# EAGLE design usbExpansion (EAGLE 4.16)
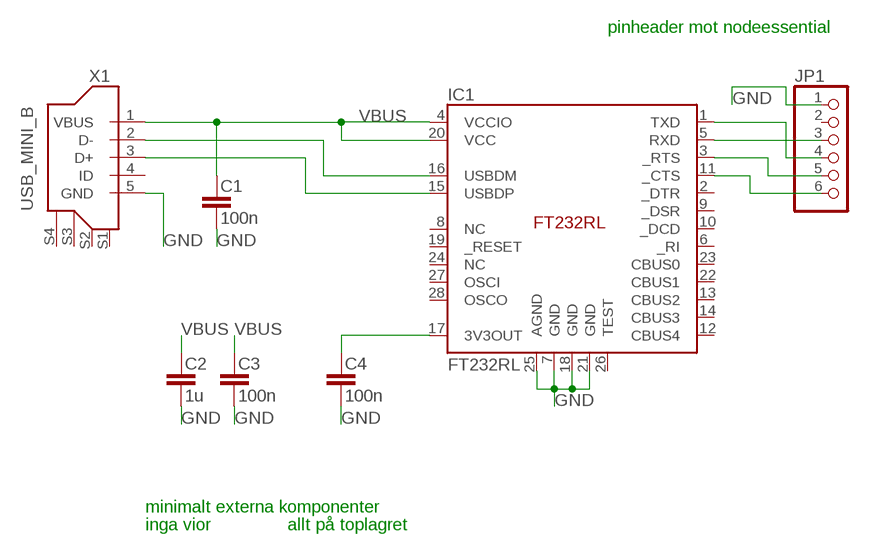
[diagram p0: schematic, sheet 1]

## Parts
C1  100n  C-EU  [C0603]
C2  1u  C-EU  [C0603]
C3  100n  C-EU  [C0603]
C4  100n  C-EU  [C0603]
IC1  FT232RL  [SSOP-28]
JP1  PINHD-1X6  [1X06]
X1  USB_MINI_B  [MOLEX67503]

## Nets
D+: IC1.15(USBDP) X1.3(D+)
D-: IC1.16(USBDM) X1.2(D-)
GND: C1.2 C2.2 C3.2 C4.2 IC1.7(GND) IC1.18(GND) IC1.21(GND) IC1.25(AGND) JP1.1 X1.5(GND)
N$1: IC1.3(_RTS) JP1.5
N$2: IC1.11(_CTS) JP1.6
N$3: C4.1 IC1.17(3V3OUT)
N$4: IC1.1(TXD) JP1.4
N$5: IC1.5(RXD) JP1.3
VBUS: C1.1 C2.1 C3.1 IC1.4(VCCIO) IC1.20(VCC) X1.1(VBUS)
Unconnected: IC1.2(_DTR) IC1.6(_RI) IC1.8(NC) IC1.9(_DSR) IC1.10(_DCD) IC1.12(CBUS4) IC1.13(CBUS2) IC1.14(CBUS3) IC1.19(_RESET) IC1.22(CBUS1) IC1.23(CBUS0) IC1.24(NC) IC1.26(TEST) IC1.27(OSCI) IC1.28(OSCO) JP1.2 X1.4(ID) X1.S1 X1.S2 X1.S3 X1.S4

## Notes on the sheet
- pinheader mot nodeessential
- minimalt externa komponenter
- inga vior | allt på toplagret

## Library data of the parts
C1-C4 = rcl:C-EU
IC1 = ftdi4:FT232RL
JP1 = pinhead-mm:PINHD-1X6
X1 = usbminib:USB_MINI_B

## Board
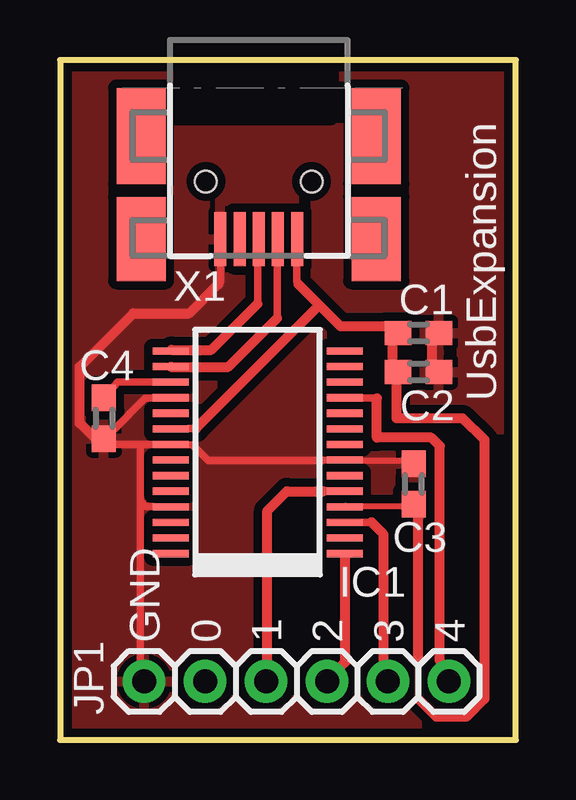
[diagram p1: board, top side]
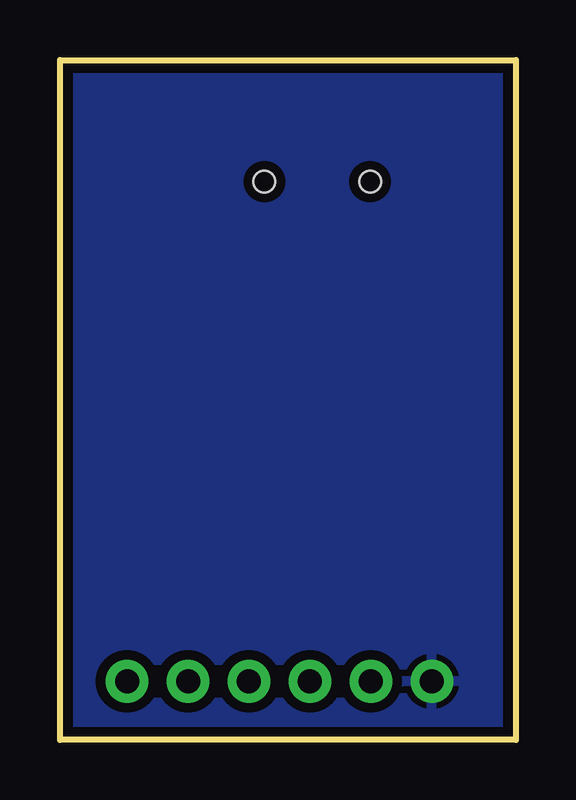
[diagram p2: board, bottom side, seen from below]

Size 19 x 28.35 mm. Coordinates in mm from the lower left corner, seen from the top.
Outline: 0,0 19,0 19,28.35 0,28.35 0,0
Copper layers (1*16): Top 0.035mm / dielectric 1.5mm / Bottom 0.035mm
Design rules "10mils": minimum track width 10mil, minimum drill 0.7mm, track to track 10mil, track to pad 10mil, pad to pad 10mil, via to via 10mil, smd to smd 10mil, copper to edge 10mil, drill to drill 10mil, minimum pad ring 10mil, minimum via ring 10mil, stop-mask expansion 0mil, vias tented up to drill 0mil, thermal gap 10mil

### Footprints (pad centres in the part's own frame; a part is rotated, then mirrored left to right if it is on the bottom)
C0603 = smd 1.1 x 1: 1 -0.85,0; 2 0.85,0
SSOP-28 = smd 0.3 x 1.5: 1 -4.225,-3.625; 2 -3.575,-3.625; 3 -2.925,-3.625; 4 -2.275,-3.625; 5 -1.625,-3.625; 6 -0.975,-3.625; 7 -0.325,-3.625; 8 0.325,-3.625; 9 0.975,-3.625; 10 1.625,-3.625; 11 2.275,-3.625; 12 2.925,-3.625; 13 3.575,-3.625; 14 4.225,-3.625; 15 4.225,3.625; 16 3.575,3.625; 17 2.925,3.625; 18 2.275,3.625; 19 1.625,3.625; 20 0.975,3.625; 21 0.325,3.625; 22 -0.325,3.625; 23 -0.975,3.625; 24 -1.625,3.625; 25 -2.275,3.625; 26 -2.925,3.625; 27 -3.575,3.625; 28 -4.225,3.625
1X06 = drill 1 pad 1.778 round: 1 -6.35,0; 2 -3.81,0; 3 -1.27,0; 4 1.27,0; 5 3.81,0; 6 6.35,0
MOLEX67503 = smd 2.25 x 0.5: 1 6.3,1.6; 2 6.3,0.8; 3 6.3,0; 4 6.3,-0.8; 5 6.3,-1.6 | smd 3.5 x 2.05: S1 6.3,4.9; S2 6.3,-4.9 | smd 4 x 2.05: S3 2,4.9; S4 2,-4.9 | hole 0.9: 3.9,2.2; 3.9,-2.2

### Placement (x,y rotation side)
C1  14.94,16.97 0 top
C2  14.94,15.34 0 top
C3  14.73,10.67 90 top
C4  1.83,13.41 270 top
IC1  8.23,11.99 90 top
JP1  9.86,2.44 0 top
X1  8.28,27.18 270 top

### Tracks (layer width: path | path; a pad name or v marks a point on that pad's centre or on a via)
D+
  Top 0.305: IC1.15 4.65,16.26 | 8.23,19.91 8.3,19.91 | 8.23,18.19 8.23,19.91 | X1.3 8.23,20.83 8.23,19.91
  Top 0.406: 4.65,16.26 6.3,16.26 8.23,18.19
D-
  Top 0.305: IC1.16 4.62,15.54 | X1.2 9.04,20.83 9.04,17.58
  Top 0.406: 4.62,15.54 7.01,15.54 9.04,17.58
GND
  Top 0.254: C3.2 14.25,11.66 12.6,11.66 IC1.7 | 2.31,12.32 C4.2 | 3.86,12.32 IC1.21 | 3.35,10.06 3.34,9.97 3.35,9.88
  Top 0.305: C2.2 15.52,15.72 | 3.35,12.32 3.86,12.32 | 3.35,12.32 2.31,12.32 | 3.34,9.97 3.58,9.73 3.86,9.73 IC1.25 | 3.35,10.06 3.35,12.32 | IC1.18 3.86,14.25 3.56,14.25 2.21,12.9 C4.2 1.76,12.5 1.52,12.5 | IC1.7 10.92,11.66 6.17,11.66 5.54,12.29 IC1.21 | 3.35,9.88 3.35,3.3 JP1.1 | X1.5 6.68,20.85 6.71,20.83 6.71,19.91 | 6.6,19 6.71,19.1 6.71,19.91 | 6.71,19.91 6.6,19.91
  Top 0.406: 1.52,12.5 0.81,13.21 0.81,15.54 3.05,17.78 5.38,17.78 6.6,19 | C1.2 15.65,16.97 15.52,16.84 15.52,15.72
  pour Top (isolate 0.356): 0.3,28.14 18.8,28.14 18.8,0.41 0.3,0.41
  pour Bottom (isolate 0.406): 0.3,28.14 18.8,28.14 18.8,0.41 0.3,0.41
N$1
  Top 0.305: 12.98,9.07 12.6,9.07 IC1.3
  Top 0.406: 12.98,9.07 13.49,8.56 13.49,3.3 JP1.5
N$2
  Top 0.305: 13.21,14.25 12.5,14.25 IC1.11 | JP1.6 15.82,3.3
  Top 0.406: 13.21,14.25 13.21,12.6 15.47,12.6 15.82,12.24 15.82,3.3
N$3
  Top 0.305: C4.1 2.41,14.91 3.86,14.91 IC1.17
N$4
  Top 0.305: IC1.1 11.89,7.76 11.89,7.62
  Top 0.406: JP1.4 11.13,2.49 11.89,3.25 11.89,7.62
N$5
  Top 0.305: IC1.5 10.97,10.36
  Top 0.406: 10.97,10.36 9.45,10.36 8.64,9.55 8.64,2.54 8.59,2.49 JP1.3
VBUS
  Top 0.254: C3.1 14.25,9.73 11.91,9.73 11.89,9.75 IC1.4 | 14.94,1.7 14.94,3.25 | 5.38,12.98 5.38,13 5.34,12.96 IC1.20 | 14.22,16.97 C1.1 14.02,16.97
  Top 0.305: 5.66,12.98 5.38,12.98 5.33,12.98 | 14.94,9.27 C3.1 | C2.1 14.02,15.27 | X1.1 9.88,20.85 9.86,20.83 9.86,19.1 9.96,19 9.93,19
  Top 0.406: 10.81,18.12 9.93,19 | 10.81,18.12 11.68,17.25 13.84,17.25 13.84,17.17 | 5.66,12.98 10.81,18.12 | 14.94,3.25 14.94,9.27 | 14.94,1.7 15.67,0.96 16.94,0.96 17.68,1.7 17.68,12.52 16.76,13.41 14.02,13.41 14.02,15.27 | C2.1 14.09,15.38 13.84,15.62 13.84,17.17 | 13.84,17.17 13.82,17.17 14.02,16.97

### Text on the board
tPlace: UsbExpansion | GND | 0 | 1 | 2 | 3 | 4